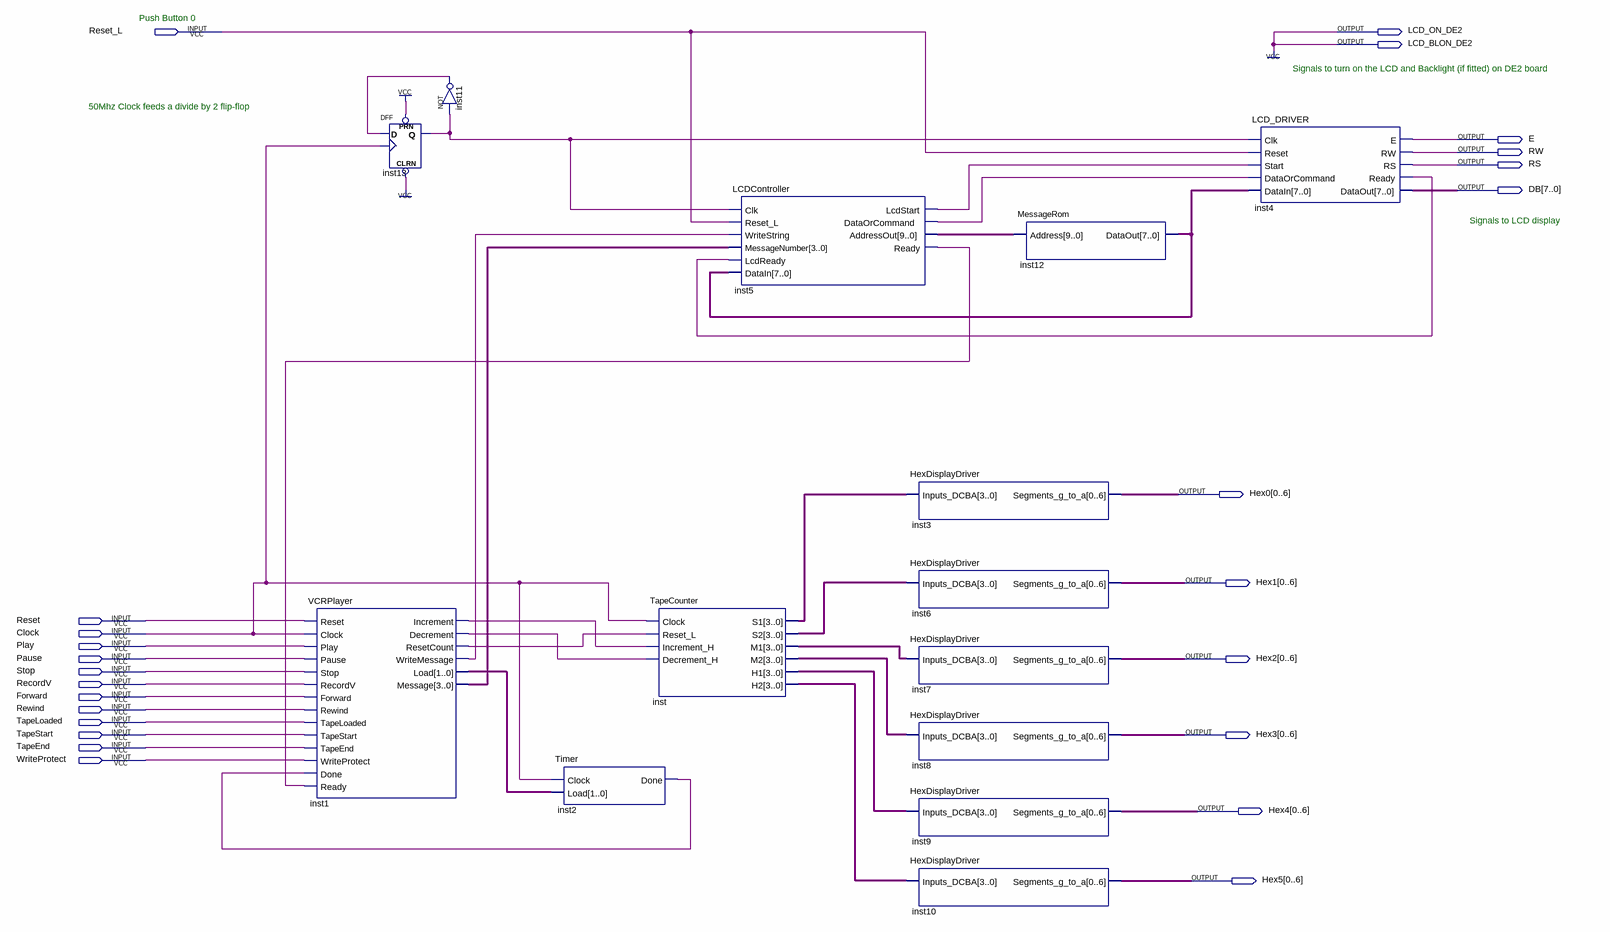
[diagram p0: schematic sheet]
// Quartus schematic VCRStateMachine.bdf as structural Verilog: 14 symbols, 25 pins
module VCRStateMachine (
  input  Reset_L,
  input  Reset,
  input  Clock,
  input  Play,
  input  Pause,
  input  Stop,
  input  RecordV,
  input  Forward,
  input  Rewind,
  input  TapeLoaded,
  input  TapeStart,
  input  TapeEnd,
  input  WriteProtect,
  output LCD_ON_DE2,
  output LCD_BLON_DE2,
  output E,
  output RW,
  output RS,
  output [7:0] DB,
  output [0:6] Hex0,
  output [0:6] Hex1,
  output [0:6] Hex2,
  output [0:6] Hex3,
  output [0:6] Hex4,
  output [0:6] Hex5
);

  wire inst1_decrement, inst1_increment, inst1_resetcount, inst1_writemessage, inst2_done, inst4_ready,
       inst5_dataorcommand, inst5_lcdstart, inst5_ready, inst11_out, inst13_q;
  wire [1:0] inst1_load;
  wire [3:0] inst1_message, inst_h1, inst_h2, inst_m1, inst_m2, inst_s1, inst_s2;
  wire [7:0] inst12_dataout;
  wire [9:0] inst5_addressout;

  VCRPlayer inst1 (
    .Reset(Reset), .Clock(Clock), .Play(Play), .Pause(Pause), .Stop(Stop), .RecordV(RecordV),
    .Forward(Forward), .Rewind(Rewind), .TapeLoaded(TapeLoaded), .TapeStart(TapeStart), .TapeEnd(TapeEnd),
    .WriteProtect(WriteProtect), .Done(inst2_done), .Ready(inst5_ready), .Increment(inst1_increment),
    .Decrement(inst1_decrement), .ResetCount(inst1_resetcount), .WriteMessage(inst1_writemessage),
    .Load(inst1_load), .Message(inst1_message));
  DFF inst13 (.CLRN(1'b1), .CLK(Clock), .D(inst11_out), .PRN(1'b1), .Q(inst13_q));
  not inst11 (inst11_out, inst13_q);
  Timer inst2 (.Clock(Clock), .Load(inst1_load), .Done(inst2_done));
  TapeCounter inst (
    .Clock(Clock), .Reset_L(inst1_resetcount), .Increment_H(inst1_increment), .Decrement_H(inst1_decrement),
    .S1(inst_s1), .S2(inst_s2), .M1(inst_m1), .M2(inst_m2), .H1(inst_h1), .H2(inst_h2));
  LCDController inst5 (
    .Clk(inst13_q), .Reset_L(Reset_L), .WriteString(inst1_writemessage), .MessageNumber(inst1_message),
    .LcdReady(inst4_ready), .DataIn(inst12_dataout), .LcdStart(inst5_lcdstart),
    .DataOrCommand(inst5_dataorcommand), .AddressOut(inst5_addressout), .Ready(inst5_ready));
  HexDisplayDriver inst3 (.Inputs_DCBA(inst_s1), .Segments_g_to_a(Hex0));
  HexDisplayDriver inst6 (.Inputs_DCBA(inst_s2), .Segments_g_to_a(Hex1));
  HexDisplayDriver inst7 (.Inputs_DCBA(inst_m1), .Segments_g_to_a(Hex2));
  HexDisplayDriver inst8 (.Inputs_DCBA(inst_m2), .Segments_g_to_a(Hex3));
  HexDisplayDriver inst9 (.Inputs_DCBA(inst_h1), .Segments_g_to_a(Hex4));
  HexDisplayDriver inst10 (.Inputs_DCBA(inst_h2), .Segments_g_to_a(Hex5));
  MessageRom inst12 (.Address(inst5_addressout), .DataOut(inst12_dataout));
  LCD_DRIVER inst4 (
    .Clk(inst13_q), .Reset(Reset_L), .Start(inst5_lcdstart), .DataOrCommand(inst5_dataorcommand),
    .DataIn(inst12_dataout), .E(E), .RW(RW), .RS(RS), .Ready(inst4_ready), .DataOut(DB));

  assign LCD_BLON_DE2 = 1'b1;
  assign LCD_ON_DE2 = 1'b1;

  // Notes on the sheet:
  //   Push Button 0
  //   Signals to turn on the LCD and Backlight (if fitted) on DE2 board
  //   50Mhz Clock feeds a divide by 2 flip-flop
  //   Signals to LCD display
endmodule
